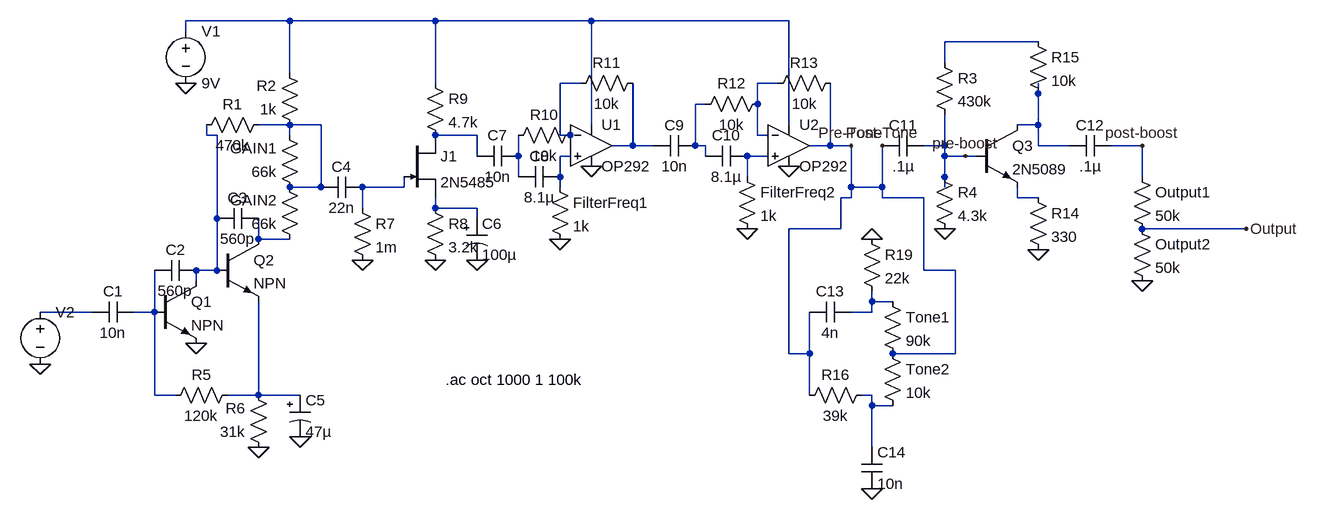
[diagram p0: schematic goose-down.asc]
goose-down.asc, the LTspice schematic file:
Version 4
SHEET 1 1832 680
WIRE 272 -96 112 -96
WIRE 496 -96 272 -96
WIRE 736 -96 496 -96
WIRE 1040 -96 736 -96
WIRE 112 -80 112 -96
WIRE 1424 -64 1280 -64
WIRE 1280 -32 1280 -64
WIRE 272 -16 272 -96
WIRE 496 0 496 -96
WIRE 720 0 688 0
WIRE 1024 0 992 0
WIRE 1424 16 1424 0
WIRE 912 32 896 32
WIRE 992 32 992 0
WIRE 272 64 224 64
WIRE 320 64 272 64
WIRE 736 64 736 -96
WIRE 1040 64 1040 -96
WIRE 1424 64 1424 16
WIRE 1424 64 1392 64
WIRE 144 80 144 64
WIRE 160 80 144 80
WIRE 272 80 272 64
WIRE 560 80 496 80
WIRE 688 80 688 0
WIRE 704 80 688 80
WIRE 992 80 992 32
WIRE 1008 80 992 80
WIRE 800 96 800 0
WIRE 800 96 768 96
WIRE 832 96 800 96
WIRE 896 96 896 32
WIRE 912 96 896 96
WIRE 1104 96 1104 0
WIRE 1104 96 1072 96
WIRE 1136 96 1104 96
WIRE 1280 96 1280 48
WIRE 1280 96 1248 96
WIRE 1424 96 1424 64
WIRE 1472 96 1424 96
WIRE 1584 96 1536 96
WIRE 560 112 560 80
WIRE 624 112 624 80
WIRE 704 112 688 112
WIRE 912 112 912 96
WIRE 1008 112 976 112
WIRE 1280 112 1280 96
WIRE 1312 112 1280 112
WIRE 1328 112 1312 112
WIRE 624 144 624 112
WIRE 688 144 688 112
WIRE 976 144 976 112
WIRE 1280 144 1280 112
WIRE 1584 144 1584 96
WIRE 320 160 320 64
WIRE 320 160 272 160
WIRE 448 160 448 144
WIRE 448 160 384 160
WIRE 688 160 688 144
WIRE 1136 160 1136 96
WIRE 1184 160 1184 96
WIRE 1184 160 1136 160
WIRE 1280 160 1280 144
WIRE 1136 176 1136 160
WIRE 1136 176 1120 176
WIRE 1184 176 1184 160
WIRE 1248 176 1184 176
WIRE 1392 176 1392 160
WIRE 1424 176 1392 176
WIRE 384 192 384 160
WIRE 496 192 496 176
WIRE 560 192 496 192
WIRE 160 208 160 80
WIRE 560 208 560 192
WIRE 1120 224 1120 176
WIRE 1120 224 1040 224
WIRE 1744 224 1584 224
WIRE 224 240 224 208
WIRE 272 240 224 240
WIRE 160 288 160 208
WIRE 160 288 128 288
WIRE 1248 288 1248 176
WIRE 1296 288 1248 288
WIRE 128 304 128 288
WIRE 1168 336 1168 320
WIRE 1200 336 1168 336
WIRE -32 352 -112 352
WIRE 64 352 64 288
WIRE 64 352 32 352
WIRE 1168 352 1168 336
WIRE 1168 352 1136 352
WIRE 1040 416 1040 224
WIRE 1072 416 1072 352
WIRE 1072 416 1040 416
WIRE 1296 416 1296 288
WIRE 1296 416 1200 416
WIRE 64 480 64 352
WIRE 96 480 64 480
WIRE 224 480 224 336
WIRE 224 480 176 480
WIRE 288 480 224 480
WIRE 1072 480 1072 416
WIRE 1168 480 1152 480
WIRE 1168 496 1168 480
WIRE 1200 496 1168 496
WIRE 1168 560 1168 496
FLAG 128 400 0
FLAG 224 560 0
FLAG 288 544 0
FLAG 384 272 0
FLAG 496 272 0
FLAG 560 272 0
FLAG 688 240 0
FLAG 976 224 0
FLAG 1040 128 0
FLAG 736 128 0
FLAG 112 0 0
FLAG -112 432 0
FLAG 1280 224 0
FLAG 1424 256 0
FLAG 1584 304 0
FLAG 1744 224 Output
FLAG 1312 112 pre-boost
FLAG 1584 96 post-boost
FLAG 1168 240 0
FLAG 1168 624 0
FLAG 1184 96 Post-Tone
FLAG 1136 96 Pre-Tone
SYMBOL voltage -112 336 R0
SYMATTR InstName V2
SYMATTR Value ""
SYMATTR Value2 AC 1
SYMBOL cap 32 336 R90
WINDOW 0 0 32 VBottom 2
WINDOW 3 32 32 VTop 2
SYMATTR InstName C1
SYMATTR Value 10n
SYMBOL cap 128 272 R90
WINDOW 0 0 32 VBottom 2
WINDOW 3 32 32 VTop 2
SYMATTR InstName C2
SYMATTR Value 560p
SYMBOL npn 64 304 R0
SYMATTR InstName Q1
SYMBOL npn 160 240 R0
SYMATTR InstName Q2
SYMBOL cap 224 192 R90
WINDOW 0 0 32 VBottom 2
WINDOW 3 32 32 VTop 2
SYMATTR InstName C3
SYMATTR Value 560p
SYMBOL res 240 48 R90
WINDOW 0 0 56 VBottom 2
WINDOW 3 32 56 VTop 2
SYMATTR InstName R1
SYMATTR Value 470k
SYMBOL res 288 80 R180
WINDOW 0 36 76 Left 2
WINDOW 3 36 40 Left 2
SYMATTR InstName R2
SYMATTR Value 1k
SYMBOL res 288 176 R180
WINDOW 0 36 76 Left 2
WINDOW 3 36 40 Left 2
SYMATTR InstName GAIN1
SYMATTR Value 66k
SYMBOL res 288 256 R180
WINDOW 0 36 76 Left 2
WINDOW 3 36 40 Left 2
SYMATTR InstName GAIN2
SYMATTR Value 66k
SYMBOL cap 384 144 R90
WINDOW 0 0 32 VBottom 2
WINDOW 3 32 32 VTop 2
SYMATTR InstName C4
SYMATTR Value 22n
SYMBOL res 192 464 R90
WINDOW 0 0 56 VBottom 2
WINDOW 3 32 56 VTop 2
SYMATTR InstName R5
SYMATTR Value 120k
SYMBOL res 240 576 R180
WINDOW 0 36 76 Left 2
WINDOW 3 36 40 Left 2
SYMATTR InstName R6
SYMATTR Value 31k
SYMBOL polcap 272 480 R0
SYMATTR InstName C5
SYMATTR Value 47µ
SYMBOL res 368 176 R0
SYMATTR InstName R7
SYMATTR Value 1m
SYMBOL res 480 176 R0
SYMATTR InstName R8
SYMATTR Value 3.2k
SYMBOL res 480 -16 R0
SYMATTR InstName R9
SYMATTR Value 4.7k
SYMBOL njf 448 80 R0
SYMATTR InstName J1
SYMATTR Value 2N5485
SYMBOL polcap 544 208 R0
SYMATTR InstName C6
SYMATTR Value 100µ
SYMBOL voltage 112 -96 R0
SYMATTR InstName V1
SYMATTR Value 9V
SYMBOL cap 624 96 R90
WINDOW 0 0 32 VBottom 2
WINDOW 3 32 32 VTop 2
SYMATTR InstName C7
SYMATTR Value 10n
SYMBOL Opamps/OP292 736 32 R0
SYMATTR InstName U1
SYMBOL res 720 64 R90
WINDOW 0 0 56 VBottom 2
WINDOW 3 32 56 VTop 2
SYMATTR InstName R10
SYMATTR Value 10k
SYMBOL cap 688 128 R90
WINDOW 0 0 32 VBottom 2
WINDOW 3 32 32 VTop 2
SYMATTR InstName C8
SYMATTR Value 8.1µ
SYMBOL res 816 -16 R90
WINDOW 0 0 56 VBottom 2
WINDOW 3 32 56 VTop 2
SYMATTR InstName R11
SYMATTR Value 10k
SYMBOL cap 896 80 R90
WINDOW 0 0 32 VBottom 2
WINDOW 3 32 32 VTop 2
SYMATTR InstName C9
SYMATTR Value 10n
SYMBOL res 1008 16 R90
WINDOW 0 0 56 VBottom 2
WINDOW 3 32 56 VTop 2
SYMATTR InstName R12
SYMATTR Value 10k
SYMBOL cap 976 96 R90
WINDOW 0 0 32 VBottom 2
WINDOW 3 32 32 VTop 2
SYMATTR InstName C10
SYMATTR Value 8.1µ
SYMBOL res 1120 -16 R90
WINDOW 0 0 56 VBottom 2
WINDOW 3 32 56 VTop 2
SYMATTR InstName R13
SYMATTR Value 10k
SYMBOL Opamps/OP292 1040 32 R0
SYMATTR InstName U2
SYMBOL res 672 144 R0
SYMATTR InstName FilterFreq1
SYMATTR Value 1k
SYMBOL res 960 128 R0
SYMATTR InstName FilterFreq2
SYMATTR Value 1k
SYMBOL cap 1248 80 R90
WINDOW 0 0 32 VBottom 2
WINDOW 3 32 32 VTop 2
SYMATTR InstName C11
SYMATTR Value .1µ
SYMBOL cap 1536 80 R90
WINDOW 0 0 32 VBottom 2
WINDOW 3 32 32 VTop 2
SYMATTR InstName C12
SYMATTR Value .1µ
SYMBOL res 1264 -48 R0
SYMATTR InstName R3
SYMATTR Value 430k
SYMBOL res 1264 128 R0
SYMATTR InstName R4
SYMATTR Value 4.3k
SYMBOL res 1408 160 R0
SYMATTR InstName R14
SYMATTR Value 330
SYMBOL res 1408 -80 R0
SYMATTR InstName R15
SYMATTR Value 10k
SYMBOL res 1568 128 R0
SYMATTR InstName Output1
SYMATTR Value 50k
SYMBOL res 1568 208 R0
SYMATTR InstName Output2
SYMATTR Value 50k
SYMBOL npn 1328 64 R0
SYMATTR InstName Q3
SYMATTR Value 2N5089
SYMBOL cap 1136 336 R90
WINDOW 0 0 32 VBottom 2
WINDOW 3 32 32 VTop 2
SYMATTR InstName C13
SYMATTR Value 4n
SYMBOL res 1168 464 R90
WINDOW 0 0 56 VBottom 2
WINDOW 3 32 56 VTop 2
SYMATTR InstName R16
SYMATTR Value 39k
SYMBOL res 1184 320 R0
SYMATTR InstName Tone1
SYMATTR Value 90k
SYMBOL res 1184 400 R0
SYMATTR InstName Tone2
SYMATTR Value 10k
SYMBOL cap 1152 560 R0
SYMATTR InstName C14
SYMATTR Value 10n
SYMBOL res 1152 224 R0
SYMATTR InstName R19
SYMATTR Value 22k
TEXT 512 456 Left 2 !.ac oct 1000 1 100k

The netlist it stands for:
* goose-down.asc
V2 N019 0 AC 1
C1 N020 N019 10n
C2 N008 N020 560p
Q1 N008 N020 0 0 NPN
Q2 N017 N008 N021 0 NPN
C3 N017 N008 560p
R1 N007 N008 470k
R2 N007 N001 1k
R§GAIN1 N007 N007 66k
R§GAIN2 N017 N007 66k
C4 N014 N007 22n
R5 N021 N020 120k
R6 0 N021 31k
C5 N021 0 47µ
R7 N014 0 1m
R8 N016 0 3.2k
R9 N001 N009 4.7k
J1 N009 N014 N016 2N5485
C6 N016 0 100µ
V1 N001 0 9V
C7 N011 N009 10n
XU1 N012 N003 N001 0 N010 OP292  ; pins In+ In- V+ V- OUT
R10 N003 N011 10k
C8 N012 N011 8.1µ
R11 N010 N003 10k
C9 N006 N010 10n
R12 N004 N006 10k
C10 N013 N006 8.1µ
R13 Pre-Tone N004 10k
XU2 N013 N004 N001 0 Pre-Tone OP292  ; pins In+ In- V+ V- OUT
R§FilterFreq1 N012 0 1k
R§FilterFreq2 N013 0 1k
C11 pre-boost Pre-Tone .1µ
C12 post-boost N005 .1µ
R3 N002 pre-boost 430k
R4 pre-boost 0 4.3k
R14 N015 0 330
R15 N002 N005 10k
R§Output1 post-boost Output 50k
R§Output2 Output 0 50k
Q3 N005 pre-boost N015 0 2N5089
C13 N018 Pre-Tone 4n
R16 N022 Pre-Tone 39k
R§Tone1 N018 Pre-Tone 90k
R§Tone2 Pre-Tone N022 10k
C14 N022 0 10n
R19 0 N018 22k
.model NPN NPN
.model PNP PNP
.lib standard.bjt
.model NJF NJF
.model PJF PJF
.lib standard.jft
.ac oct 1000 1 100k
.lib ADI1.lib
.backanno
.end